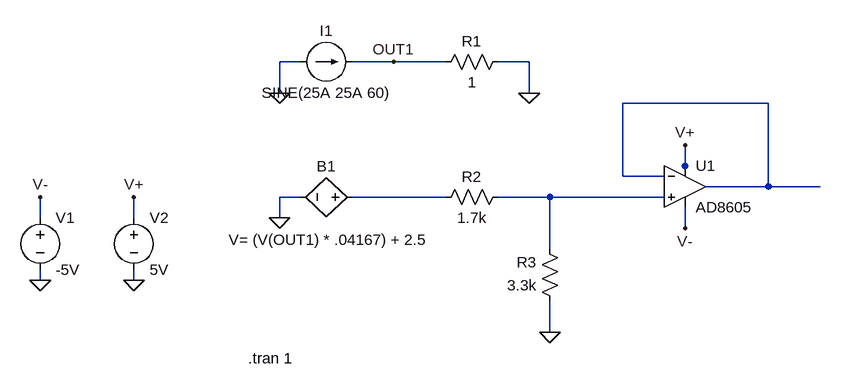
[diagram p0: schematic LEMSensorV2.asc]
LEMSensorV2.asc, the LTspice schematic file:
Version 4
SHEET 1 880 712
WIRE 48 240 16 240
WIRE 192 240 128 240
WIRE 272 240 192 240
WIRE 400 240 352 240
WIRE 16 288 16 240
WIRE 400 288 400 240
WIRE 768 304 544 304
WIRE 640 400 640 368
WIRE 544 416 544 304
WIRE 608 416 544 416
WIRE 640 416 640 400
WIRE 768 432 768 304
WIRE 768 432 672 432
WIRE 848 432 768 432
WIRE 48 448 16 448
WIRE 272 448 128 448
WIRE 432 448 352 448
WIRE 608 448 432 448
WIRE -352 480 -352 448
WIRE -208 480 -208 448
WIRE 16 480 16 448
WIRE 640 496 640 464
WIRE 432 528 432 448
WIRE -352 576 -352 560
WIRE -208 576 -208 560
WIRE 432 656 432 608
FLAG 16 288 0
FLAG 400 288 0
FLAG 192 240 OUT1
FLAG 16 480 0
FLAG 432 656 0
FLAG -208 576 0
FLAG -352 576 0
FLAG -208 448 V+
FLAG -352 448 V-
FLAG 640 496 V-
FLAG 640 368 V+
SYMBOL current 48 240 R270
WINDOW 0 32 40 VTop 2
WINDOW 3 -32 40 VBottom 2
SYMATTR InstName I1
SYMATTR Value SINE(25A 25A 60)
SYMBOL bv 144 448 R90
WINDOW 0 -32 56 VBottom 2
WINDOW 3 50 52 VTop 2
SYMATTR InstName B1
SYMATTR Value V= (V(OUT1) * .04167) + 2.5
SYMBOL res 368 224 R90
WINDOW 0 0 56 VBottom 2
WINDOW 3 32 56 VTop 2
SYMATTR InstName R1
SYMATTR Value 1
SYMBOL res 368 432 R90
WINDOW 0 0 56 VBottom 2
WINDOW 3 32 56 VTop 2
SYMATTR InstName R2
SYMATTR Value 1.7k
SYMBOL res 448 624 R180
WINDOW 0 36 76 Left 2
WINDOW 3 36 40 Left 2
SYMATTR InstName R3
SYMATTR Value 3.3k
SYMBOL OpAmps/AD8605 640 368 R0
SYMATTR InstName U1
SYMBOL voltage -352 464 R0
SYMATTR InstName V1
SYMATTR Value -5V
SYMBOL voltage -208 464 R0
SYMATTR InstName V2
SYMATTR Value 5V
TEXT -32 696 Left 2 !.tran 1

The netlist it stands for:
* LEMSensorV2.asc
I1 0 OUT1 SINE(25A 25A 60)
B1 N002 0 V= (V(OUT1) * .04167) + 2.5
R1 0 OUT1 1
R2 N003 N002 1.7k
R3 0 N003 3.3k
XU1 N003 N001 V+ V- N001 AD8605  ; pins In+ In- V+ V- OUT
V1 V- 0 -5V
V2 V+ 0 5V
.tran 1
.lib ADI.lib
.backanno
.end